# EAGLE design SRX Mag Breakout Rev3 (EAGLE 9.6.2)
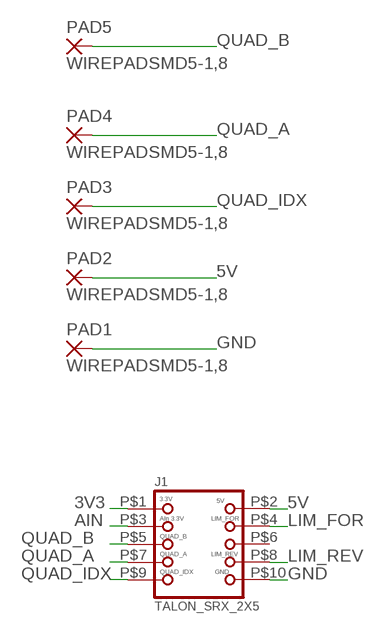
[diagram p0: schematic, sheet 1]

## Parts
J1  TALON_SRX_2X5  [2X5-0.05-HEADER]
PAD1  WIREPADSMD5-1,8  [5-1,8]
PAD2  WIREPADSMD5-1,8  [5-1,8]
PAD3  WIREPADSMD5-1,8  [5-1,8]
PAD4  WIREPADSMD5-1,8  [5-1,8]
PAD5  WIREPADSMD5-1,8  [5-1,8]

## Nets
3V3: J1.P$1
5V: J1.P$2 PAD2.1(P)
AIN: J1.P$3
GND: J1.P$10 PAD1.1(P)
LIM_FOR: J1.P$4
LIM_REV: J1.P$8
QUAD_A: J1.P$7 PAD4.1(P)
QUAD_B: J1.P$5 PAD5.1(P)
QUAD_IDX: J1.P$9 PAD3.1(P)
Unconnected: J1.P$6

## Library data of the parts
J1 = Peter:TALON_SRX_2X5
PAD1-PAD5 = wirepad:WIREPAD: Wire PAD connect wire on PCB

## Board
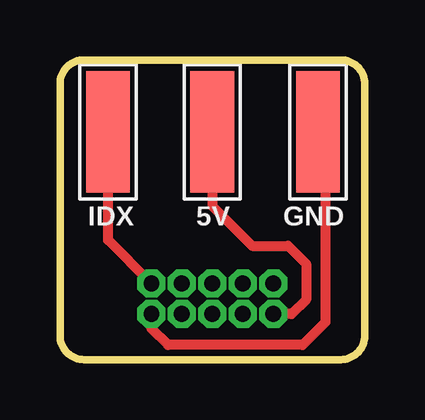
[diagram p1: board, top side]
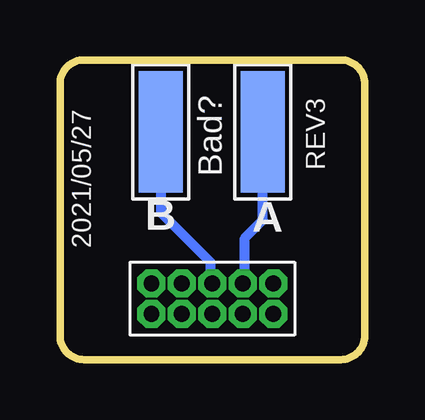
[diagram p2: board, bottom side, seen from below]

Size 12.7 x 12.5 mm. Coordinates in mm from the lower left corner, seen from the top.
Outline: 1,12.5 11.7,12.5 arc-90 12.7,11.5 12.7,1 arc-90 11.7,0 1,0 arc-90 0,1 0,11.5 arc-90 1,12.5
Copper layers (1*16): Top 0.035mm / dielectric 1.5mm / Bottom 0.035mm
Design rules "SeeedStudio_2layer_DRU_no_angle_20140221": minimum track width 6mil, minimum drill 12mil, track to track 6mil, track to pad 6mil, pad to pad 6mil, via to via 6mil, smd to smd 0mil, copper to edge 10mil, drill to drill 10mil, minimum pad ring 10mil, minimum via ring 6mil, stop-mask expansion 2mil, vias tented up to drill 100mil, thermal gap 10mil

### Footprints (pad centres in the part's own frame; a part is rotated, then mirrored left to right if it is on the bottom)
2X5-0.05-HEADER = drill 0.66 octagon: P$1 2.54,-0.635; P$2 2.54,0.635; P$3 1.27,-0.635; P$4 1.27,0.635; P$5 0,-0.635; P$6 0,0.635; P$7 -1.27,-0.635; P$8 -1.27,0.635; P$9 -2.54,-0.635; P$10 -2.54,0.635
5-1,8 = smd 1.829 x 5.08: 1 0,0

### Placement (x,y rotation side)
J1  6.35,2.54 180 bottom
PAD1  10.75,9.5 0 top
PAD2  6.35,9.5 0 top
PAD3  2,9.5 0 top
PAD4  4.25,9.5 0 bottom
PAD5  8.5,9.5 0 bottom

### Tracks (layer width: path | path; a pad name or v marks a point on that pad's centre or on a via)
5V
  Top 0.406: PAD2.1 6.35,6.4 8,4.75 9.5,4.75 10.25,4 10.25,2.5 9.65,1.91 J1.P$2
GND
  Top 0.406: PAD1.1 11.06,9.19 11.06,1.56 10.11,0.61 4.5,0.61 3.81,1.3 J1.P$10
QUAD_A
  Bottom 0.406: J1.P$7 5,3.25 5,5.06 4.25,5.81 PAD4.1
QUAD_B
  Bottom 0.406: J1.P$5 6.43,3.25 6.43,4.06 8.5,6.13 PAD5.1
QUAD_IDX
  Top 0.406: J1.P$9 2,4.99 PAD3.1

### Text on the board
tNames: IDX | 5V | GND
bNames: Bad? | REV3 | A | B | 2021/05/27